# Altium schematic sheet 09_Ebox_PhysicalConnections.SchDoc
size A4; DocumentNumber: 7; SheetNumber: 7; SheetTotal: 7
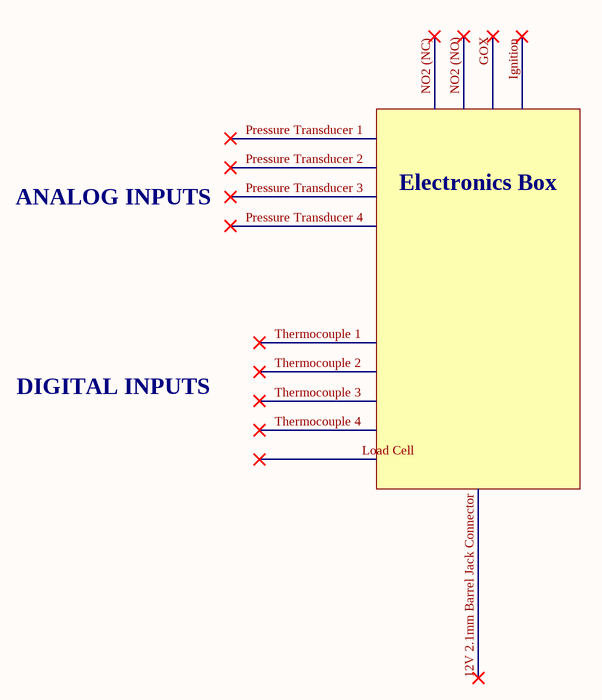
[diagram p0: 09_Ebox_PhysicalConnections.SchDoc]

## Notes on the sheet
- NO2 (NC)
- NO2 (NO)
- GOX
- Ignition
- Pressure Transducer 1
- Pressure Transducer 2
- ANALOG INPUTS
- Pressure Transducer 3
- Pressure Transducer 4
- Electronics Box
- DIGITAL INPUTS
- Thermocouple 1
- Thermocouple 2
- Thermocouple 3
- Thermocouple 4
- Load Cell
- 12V 2.1mm Barrel Jack Connector
- Title:
- Company:
- Date:
- Sheet
- of
- Drawn By: